# Altium project receiver.PrjPcb
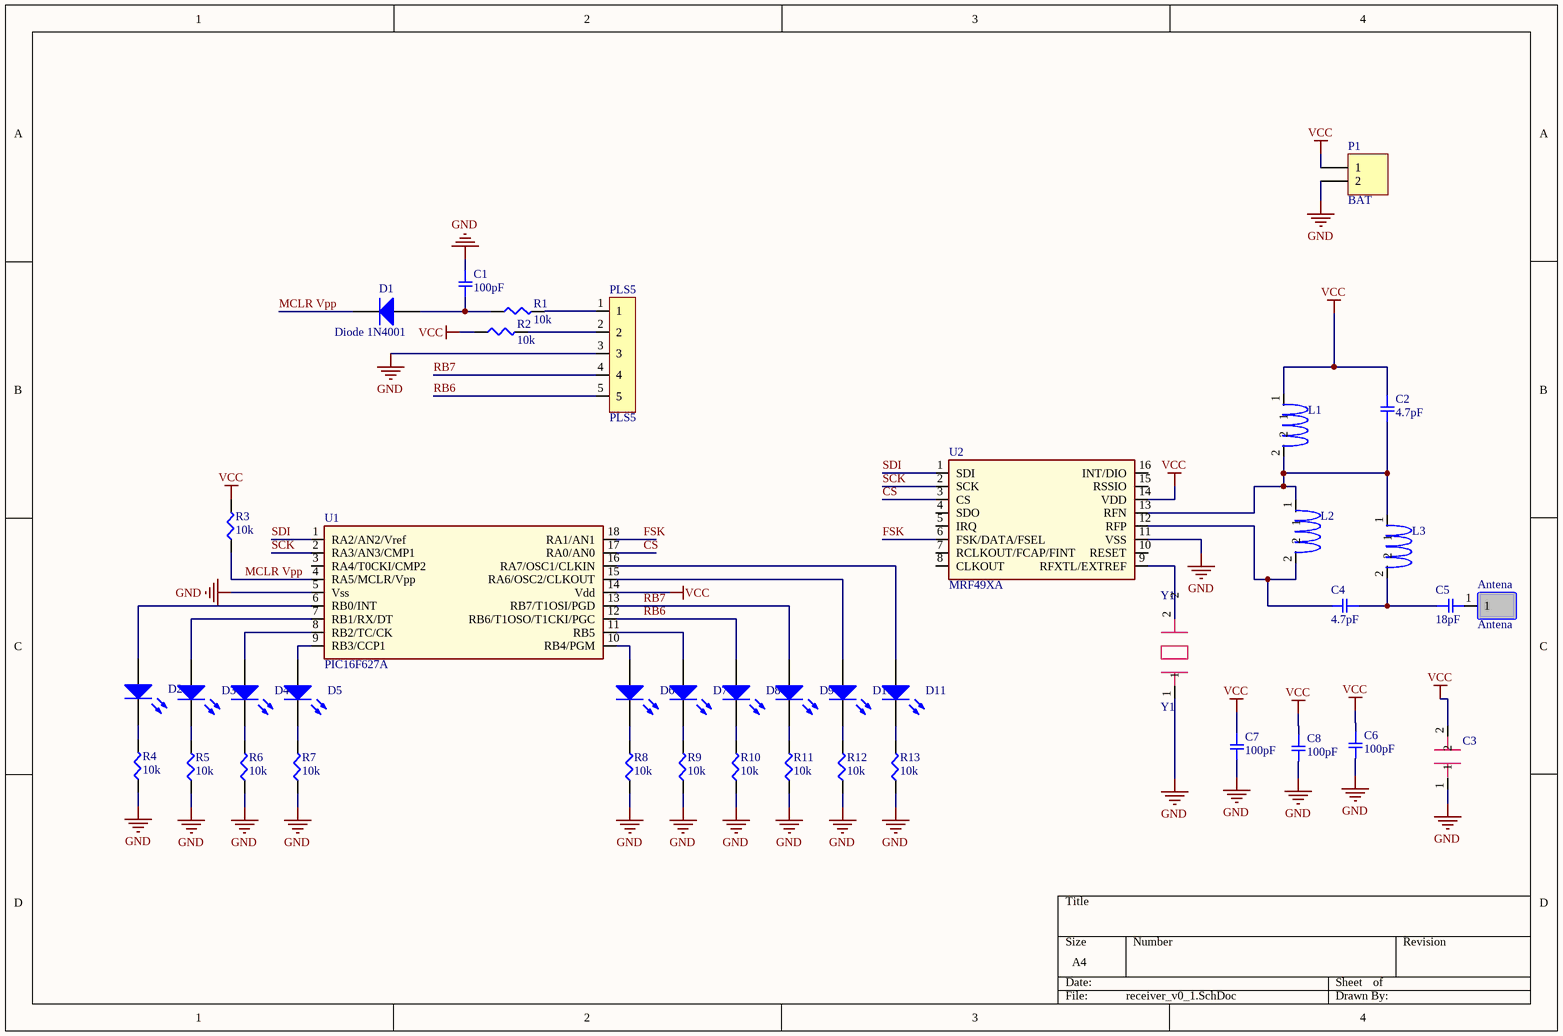
[diagram p0: receiver_v0_1.SchDoc]
1 sheet, 41 parts. Net scope: global (net labels, ports and power ports of the same name join across sheets).
Board file: receiver_v0_1.PcbDoc

## Sheet receiver_v0_1.SchDoc
size A4

### Parts
Antena  Antena  [Anteny]
C1  100pF  [SMD-1206C]
C2  4.7pF  [SMD-0805C]
C3  (no value)  [С0805]
C4  4.7pF  [SMD-0805C]
C5  18pF  [SMD-0805C]
C6  100pF  [SMD-1206C]
C7  100pF  [SMD-1206C]
C8  100pF  [SMD-1206C]
D1  Diode 1N4001  [DO-41]
D2  LED3  [3.5X2.8X1.9]  (value not drawn)
D3  LED3  [3.5X2.8X1.9]  (value not drawn)
D4  LED3  [3.5X2.8X1.9]  (value not drawn)
D5  LED3  [3.5X2.8X1.9]  (value not drawn)
D6  LED3  [3.5X2.8X1.9]  (value not drawn)
D7  LED3  [3.5X2.8X1.9]  (value not drawn)
D8  LED3  [3.5X2.8X1.9]  (value not drawn)
D9  LED3  [3.5X2.8X1.9]  (value not drawn)
D10  LED3  [3.5X2.8X1.9]  (value not drawn)
D11  LED3  [3.5X2.8X1.9]  (value not drawn)
L1  (no value)  [L?]
L2  (no value)  [L?]
L3  (no value)  [L?]
P1  BAT  [HDR1X2]
PLS5  PLS5  [PLS5]
R1  10k  [SMD-1206-RES]
R2  10k  [SMD-1206-RES]
R3  10k  [SMD-1206-RES]
R4  10k  [SMD-1206-RES]
R5  10k  [SMD-1206-RES]
R6  10k  [SMD-1206-RES]
R7  10k  [SMD-1206-RES]
R8  10k  [SMD-1206-RES]
R9  10k  [SMD-1206-RES]
R10  10k  [SMD-1206-RES]
R11  10k  [SMD-1206-RES]
R12  10k  [SMD-1206-RES]
R13  10k  [SMD-1206-RES]
U1  PIC16F627A  [PIC16F627A]
U2  MRF49XA  [MRF49XA]
Y1  Y1  [Quartz]

### Nets
GND: C1.1 C3.1 C6.2 C7.2 C8.2 P1.2 PLS5.3 R4.1 R5.1 R6.1 R7.1 R8.1 R9.1 R10.1 R11.1 R12.1 R13.1 U1.5(Vss) U2.11(VSS) Y1.1
VCC: C2.1 C3.2 C6.1 C7.1 C8.1 L1.1 P1.1 R2.1 R3.2 U1.14(Vdd) U2.14(VDD)
CS: U1.17(RA0/AN0) U2.3(CS)
FSK: U1.18(RA1/AN1) U2.6(FSK/DATA/FSEL)
MCLR Vpp: D1.2(K) R3.1 U1.4(RA5/MCLR/Vpp)
RB6: D8.1(A) PLS5.5 U1.12(RB6/T1OSO/T1CKI/PGC)
RB7: D9.1(A) PLS5.4 U1.13(RB7/T1OSI/PGD)
SCK: U1.2(RA3/AN3/CMP1) U2.2(SCK)
SDI: U1.1(RA2/AN2/Vref) U2.1(SDI)
NetAntena_1: Antena.1 C5.2
NetC1_2: C1.2 D1.1(A) R1.1
NetC2_2: C2.2 L1.2 L2.1 L3.1 U2.13(RFN)
NetC4_1: C4.1 C5.1 L3.2
NetC4_2: C4.2 L2.2 U2.12(RFP)
NetD2_1: D2.1(A) U1.6(RB0/INT)
NetD2_2: D2.2(K) R4.2
NetD3_1: D3.1(A) U1.7(RB1/RX/DT)
NetD3_2: D3.2(K) R5.2
NetD4_1: D4.1(A) U1.8(RB2/TC/CK)
NetD4_2: D4.2(K) R6.2
NetD5_1: D5.1(A) U1.9(RB3/CCP1)
NetD5_2: D5.2(K) R7.2
NetD6_1: D6.1(A) U1.10(RB4/PGM)
NetD6_2: D6.2(K) R8.2
NetD7_1: D7.1(A) U1.11(RB5)
NetD7_2: D7.2(K) R9.2
NetD8_2: D8.2(K) R10.2
NetD9_2: D9.2(K) R11.2
NetD10_1: D10.1(A) U1.15(RA6/OSC2/CLKOUT)
NetD10_2: D10.2(K) R12.2
NetD11_1: D11.1(A) U1.16(RA7/OSC1/CLKIN)
NetD11_2: D11.2(K) R13.2
NetPLS5_1: PLS5.1 R1.2
NetPLS5_2: PLS5.2 R2.2
NetU2_9: U2.9(RFXTL/EXTREF) Y1.2

Not connected (* = marked no-connect by the designer): U1 3(RA4/T0CKI/CMP2); U2 4(SDO) 5(IRQ) 7(RCLKOUT/FCAP/FINT) 8(CLKOUT) 10(RESET) 15(RSSIO) 16(INT/DIO)

### Library data of the parts
C1 C6-C8 = GCM31A7U2J101JX01D: CAP CER 100PF 630V U2J 1206; Manufacturer: Murata Electronics North America; Factory Stock: 0; Unit Price (USD): 0.51; Minimum Quantity: 1; Tolerance: ±5%; Datasheets: http://www.murata.com/~/media/webrenewal/support/library/catalog/products/capacitor/mlcc/c03e.ashx; Image: //media.digikey.com/Renders/Murata%20Renders/GR331BD72E473KW01L.jpg; Digi-Key Part Number: 490-5043-1-ND; Part Number: GCM31A7U2J101JX01D; Quantity Available: 819; @ qty: 0; Packaging: Cut Tape (CT); Series: GCM; Part Status: Active; Value: 100pF; Voltage: 630V; Temperature Coefficient: U2J; Operating Temperature: -55°C ~ 125°C; Features: -; Ratings: AEC-Q200; Applications: Automotive; Mounting Type: Surface Mount, MLCC; Package / Case: 1206 (3216 Metric); Size / Dimension: 0.126" L x 0.063" W (3.20mm x 1.60mm); Height - Seated (Max): -; Thickness (Max): 0.039" (1.00mm); Lead Spacing: -; Lead Style: -
C2 C4 = GQM2195C2A4R7BB01D: CAP CER 4.7PF 100V NP0 0805; Manufacturer: Murata Electronics North America; Factory Stock: 0; Unit Price (USD): 0.82; Minimum Quantity: 1; Tolerance: ±0.1pF; Temperature Coefficient: C0G, NP0; Datasheets: http://www.murata.com/~/media/webrenewal/support/library/catalog/products/capacitor/mlcc/c02e.pdf; Image: //media.digikey.com/Renders/Murata%20Renders/0805(GxM9).jpg; Digi-Key Part Number: 490-11278-1-ND; Part Number: GQM2195C2A4R7BB01D; Quantity Available: 897; @ qty: 0; Packaging: Cut Tape (CT); Series: GQM; Part Status: Active; Value: 4.7pF; Voltage: 100V; Operating Temperature: -55°C ~ 125°C; Features: High Q, Low Loss; Ratings: -; Applications: RF, Microwave, High Frequency; Mounting Type: Surface Mount, MLCC; Package / Case: 0805 (2012 Metric); Size / Dimension: 0.079" L x 0.049" W (2.00mm x 1.25mm); Height - Seated (Max): -; Thickness (Max): 0.037" (0.95mm); Lead Spacing: -; Lead Style: -
C3 = Capacity
C5 = GQM2195C2A180JB01D: CAP CER 18PF 100V NP0 0805; Manufacturer: Murata Electronics North America; Factory Stock: 0; Unit Price (USD): 0.91; Minimum Quantity: 1; Tolerance: ±5%; Temperature Coefficient: C0G, NP0; Datasheets: http://www.murata.com/~/media/webrenewal/support/library/catalog/products/capacitor/mlcc/c02e.pdf; Image: //media.digikey.com/Renders/Murata%20Renders/0805(GxM9).jpg; Digi-Key Part Number: 490-3606-1-ND; Part Number: GQM2195C2A180JB01D; Quantity Available: 8724; @ qty: 0; Packaging: Cut Tape (CT); Series: GQM; Part Status: Active; Value: 18pF; Voltage: 100V; Operating Temperature: -55°C ~ 125°C; Features: High Q, Low Loss; Ratings: -; Applications: RF, Microwave, High Frequency; Mounting Type: Surface Mount, MLCC; Package / Case: 0805 (2012 Metric); Size / Dimension: 0.079" L x 0.049" W (2.00mm x 1.25mm); Height - Seated (Max): -; Thickness (Max): 0.037" (0.95mm); Lead Spacing: -; Lead Style: -
D1 = Diode 1N4001: 1 Amp General Purpose Rectifier; Published: 8-Jun-2000; LatestRevisionDate: 17-Jul-2002; LatestRevisionNote: Re-released for DXP Platform.; DatasheetVersion: 1998; PackageVersion: Aug-1999; PackageReference: DO-41; Publisher: Altium Limited; PackageDescription: Diode, Axial; Body 5.2 x 2.7 mm (LxDia. max), Lead Dia. 0.86 mm (max); Code_JEDEC: DO-204-AL; ComponentLink1Description: Manufacturer Link; ComponentLink1URL: http://www.fairchildsemi.com/; ComponentLink2Description: Datasheet; ComponentLink2URL: http://www.fairchildsemi.com/ds/1N%2F1N4001.pdf
D2-D11 = LED3: Typical BLUE SiC LED; Published: 8-Jun-2000; LatestRevisionDate: 17-Dec-2003; LatestRevisionNote: PCB Footprint replaced.; DatasheetVersion: 16-Apr-2002; PackageVersion: 16-Apr-2002; PackageReference: 3.5X2.8X1.9; Publisher: Altium Limited; PackageDescription: SM LED; 2 C-Bend Leads; Body 3.5 x 2.8 x 1.9 mm, inc leads (LxWxH typ)
L1-L3 = Inductance
P1 = Header 2: Header, 2-Pin; LatestRevisionDate: 17-Jul-2002; LatestRevisionNote: Re-released for DXP Platform.; Publisher: Altium Limited
R1-R13 = ERJ-P08J103V: RES SMD 10K OHM 5% 2/3W 1206; Manufacturer: Panasonic Electronic Components; Factory Stock: 0; Unit Price (USD): 0.02178; @ qty: 1500; Minimum Quantity: 1; Power (Watts): 0.667W, 2/3W; Temperature Coefficient: ±200ppm/°C; Part Number: ERJ-P08J103V; Datasheets: https://industrial.panasonic.com/cdbs/www-data/pdf/RDA0000/AOA0000C243.pdf; Image: //media.digikey.com/Renders/Panasonic%20Renders/ERJ-1206%20Pkg.jpg; Digi-Key Part Number: P10KALCT-ND; Quantity Available: 46069; Packaging: Cut Tape (CT); Series: ERJ; Part Status: Active; Value: 10k; Tolerance: ±5%; Composition: Thick Film; Features: Automotive AEC-Q200, Pulse Withstanding; Operating Temperature: -55°C ~ 155°C; Package / Case: 1206 (3216 Metric); Supplier Device Package: 1206; Size / Dimension: 0.126" L x 0.063" W (3.20mm x 1.60mm); Height - Seated (Max): 0.028" (0.70mm); Number of Terminations: 2; Failure Rate: -
Y1 = Quartz